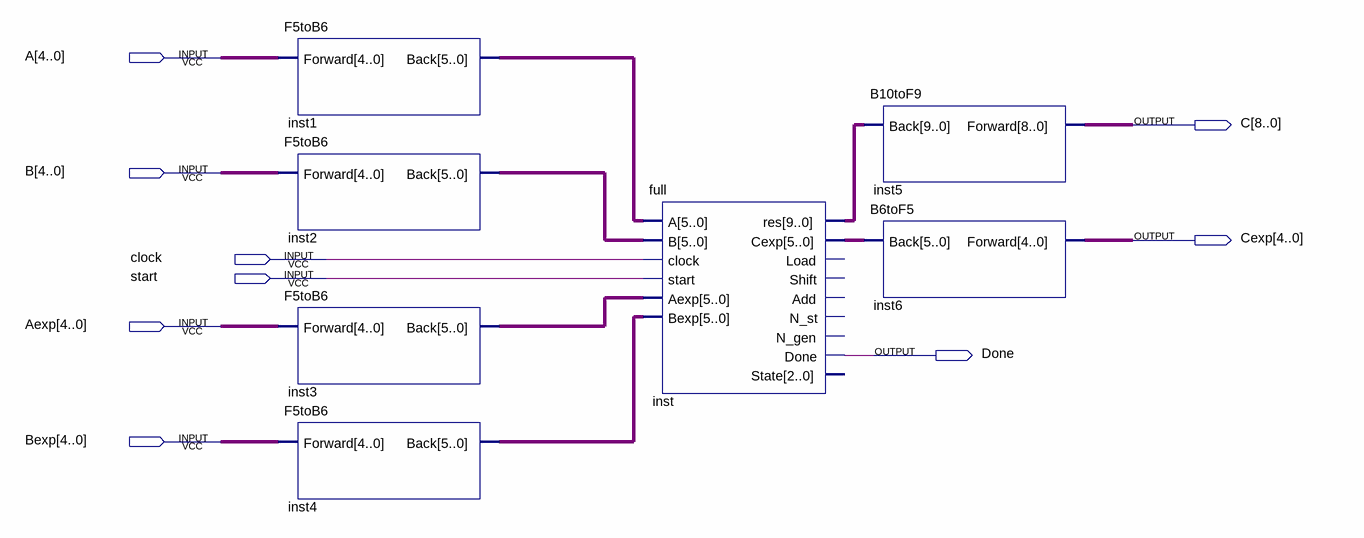
[diagram p0: schematic sheet]
// Quartus schematic multipcatcion.bdf as structural Verilog: 7 symbols, 9 pins
module multipcatcion (
  input  [4:0] A,
  input  [4:0] B,
  input  clock,
  input  start,
  input  [4:0] Aexp,
  input  [4:0] Bexp,
  output [8:0] C,
  output [4:0] Cexp,
  output Done
);

  wire [5:0] inst1_back, inst2_back, inst3_back, inst4_back, inst_cexp;
  wire [9:0] inst_res;

  F5toB6 inst1 (.Forward(A), .Back(inst1_back));
  F5toB6 inst2 (.Forward(B), .Back(inst2_back));
  F5toB6 inst3 (.Forward(Aexp), .Back(inst3_back));
  F5toB6 inst4 (.Forward(Bexp), .Back(inst4_back));
  full inst (
    .A(inst1_back), .B(inst2_back), .clock(clock), .start(start), .Aexp(inst3_back), .Bexp(inst4_back),
    .res(inst_res), .Cexp(inst_cexp), .Done(Done));  // open: Load, Shift, Add, N_st, N_gen, State
  B10toF9 inst5 (.Back(inst_res), .Forward(C));
  B6toF5 inst6 (.Back(inst_cexp), .Forward(Cexp));
endmodule
